# EAGLE design stackable_motorshield_v2 (EAGLE 6.5.0)
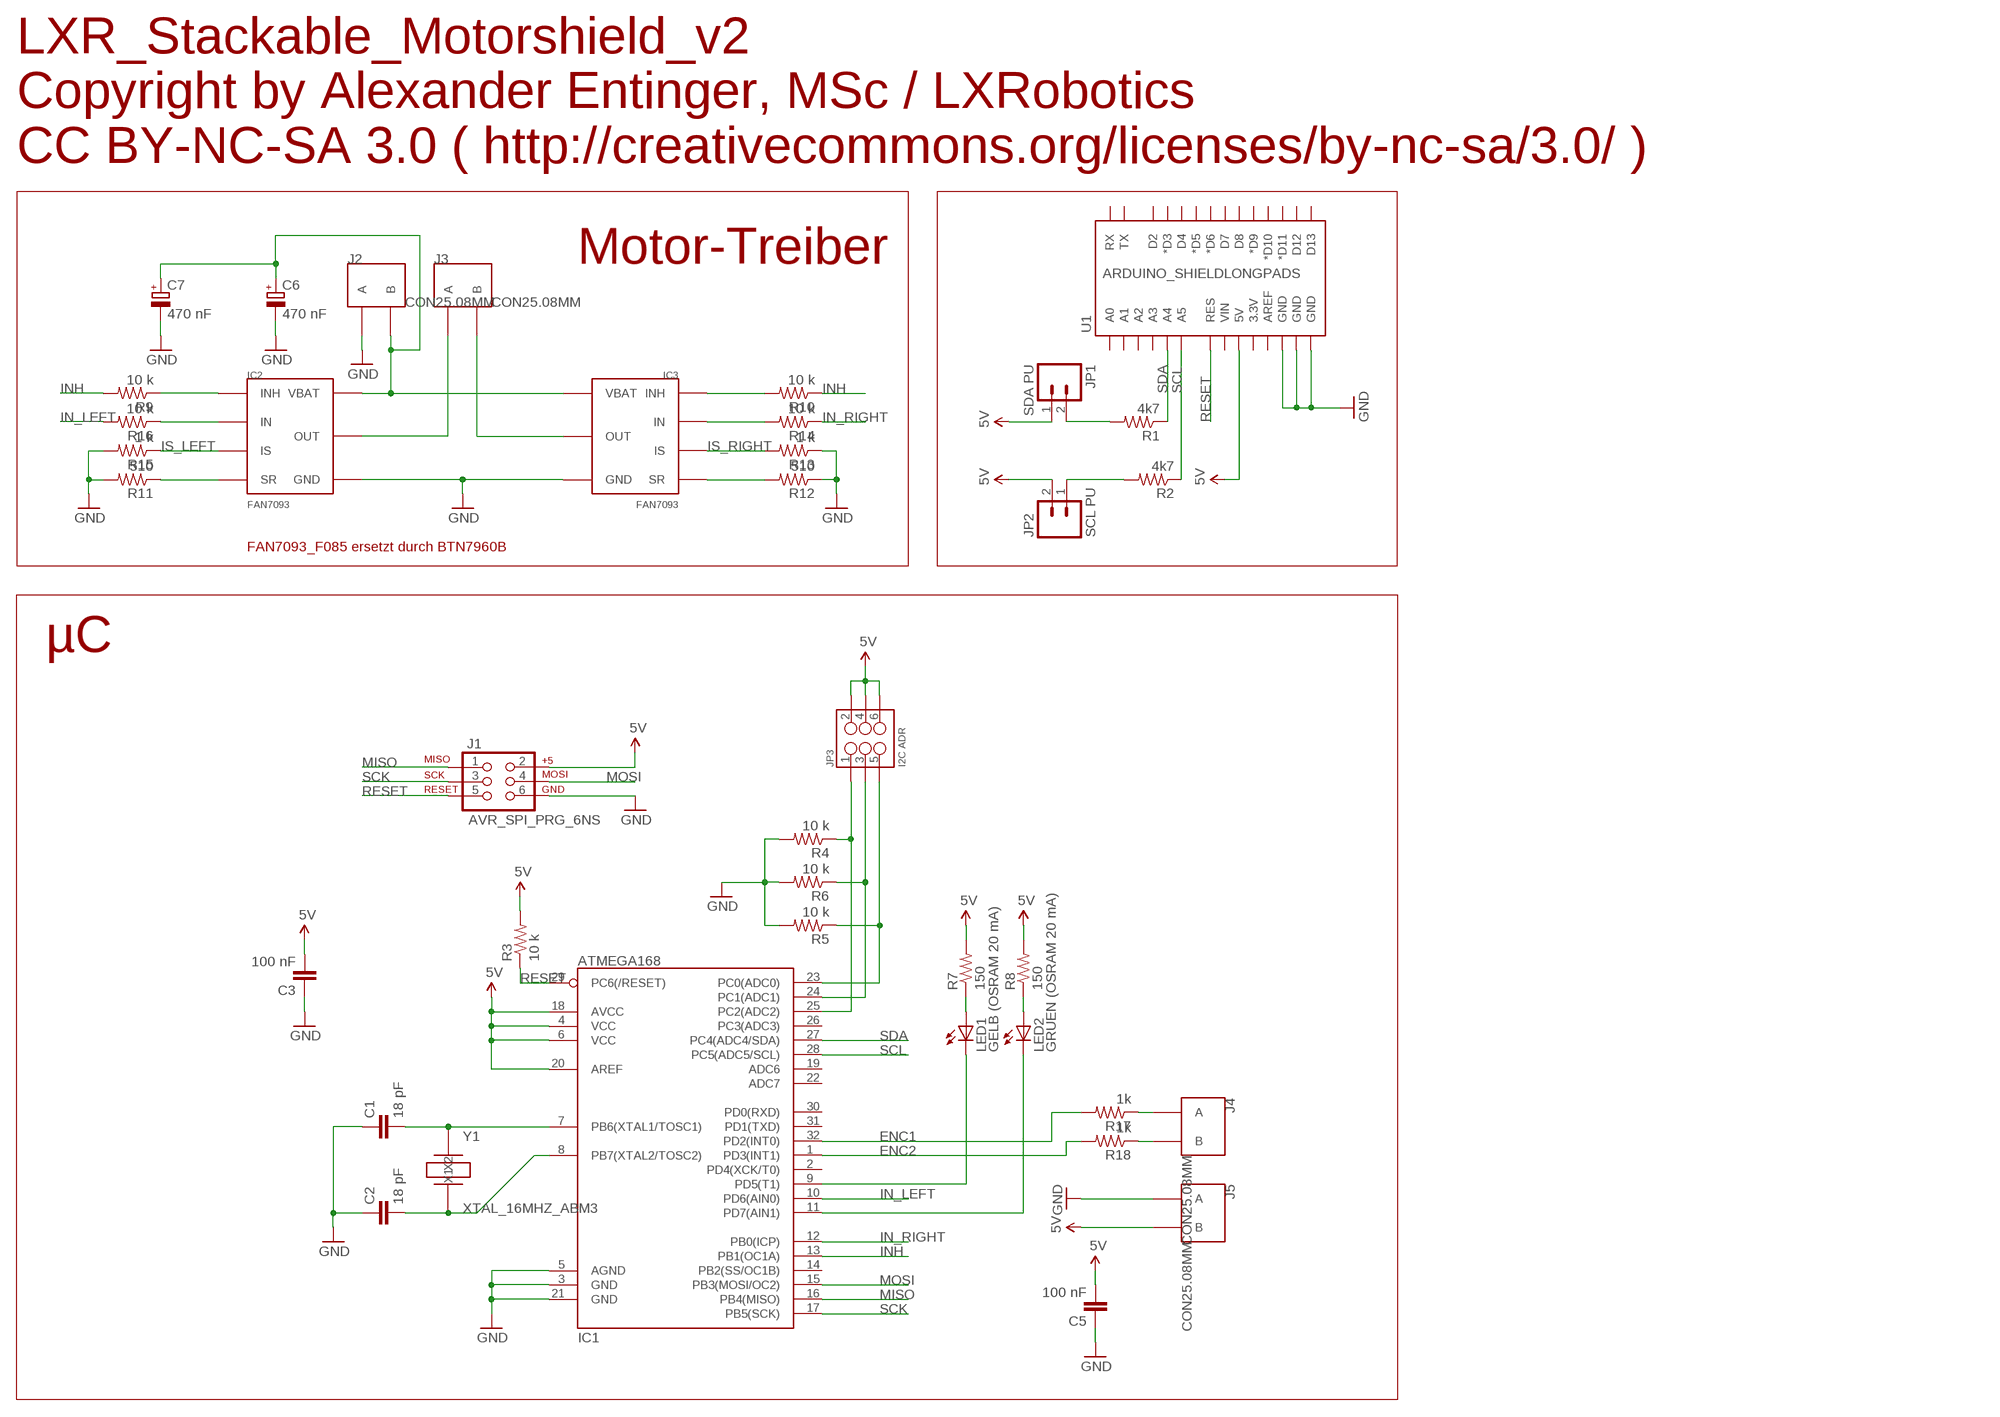
[diagram p0: schematic, sheet 1]

## Parts
C1  18 pF  C-EUC0805  [C0805]
C2  18 pF  C-EUC0805  [C0805]
C3  100 nF  C-EUC0805  [C0805]
C5  100 nF  C-EUC0805  [C0805]
C6  470 nF  CPOL-EU  [KEMET_A]
C7  470 nF  CPOL-EU  [KEMET_A]
IC1  ATMEGA168  [TQFP32-08]
IC2  FAN7093  [TO263-7L]
IC3  FAN7093  [TO263-7L]
J1  AVR_SPI_PRG_6NS  [2X3-NS]
J2  CON25.08MM  [CON2_SCHRAUBKLEMME]
J3  CON25.08MM  [CON2_SCHRAUBKLEMME]
J4  CON25.08MM  [CON2_SCHRAUBKLEMME]
J5  CON25.08MM  [CON2_SCHRAUBKLEMME]
JP1  SDA PU  M02PTH  [1X02]
JP2  SCL PU  M02PTH  [1X02]
JP3  I2C ADR  M03X2POGO_PINS  [2X3_POGO]
LED1  GELB (OSRAM 20 mA)  LEDCHIP-LED0805  [CHIP-LED0805]
LED2  GRUEN (OSRAM 20 mA)  LEDCHIP-LED0805  [CHIP-LED0805]
R1  4k7  RESISTOR0805-RES  [0805]
R2  4k7  RESISTOR0805-RES  [0805]
R3  10 k  RESISTOR0805-RES  [0805]
R4  10 k  RESISTOR0805-RES  [0805]
R5  10 k  RESISTOR0805-RES  [0805]
R6  10 k  RESISTOR0805-RES  [0805]
R7  150  RESISTOR0805-RES  [0805]
R8  150  RESISTOR0805-RES  [0805]
R9  10 k  RESISTOR0805-RES  [0805]
R10  10 k  RESISTOR0805-RES  [0805]
R11  510  RESISTOR0805-RES  [0805]
R12  510  RESISTOR0805-RES  [0805]
R13  1 k  RESISTOR0805-RES  [0805]
R14  10 k  RESISTOR0805-RES  [0805]
R15  1 k  RESISTOR0805-RES  [0805]
R16  10 k  RESISTOR0805-RES  [0805]
R17  1k  RESISTOR0805-RES  [0805]
R18  1k  RESISTOR0805-RES  [0805]
U1  ARDUINO_SHIELDLONGPADS  [DUEMILANOVE_SHIELD_LONGPADS]
Y1  XTAL_16MHZ_ABM3  [ABM3]

## Nets
5V: C3.2 C5.2 IC1.4(VCC) IC1.6(VCC) IC1.18(AVCC) IC1.20(AREF) J1.2 J5.2(B) JP1.1 JP2.2 JP3.P$2 JP3.P$4 JP3.P$6 R3.2 R7.2 R8.2 U1.5V
ENC1: IC1.32(PD2(INT0)) R17.2
ENC2: IC1.1(PD3(INT1)) R18.2
GND: C1.1 C2.1 C3.1 C5.1 C6.CATHODE(-) C7.CATHODE(-) IC1.3(GND) IC1.5(AGND) IC1.21(GND) IC2.GND IC3.GND J1.6 J2.1(A) J5.1(A) R4.2 R5.2 R6.2 R11.2 R12.1 R13.1 R15.2 U1.GND@0(GND) U1.GND@1(GND) U1.GND@2(GND)
IN_LEFT: IC1.10(PD6(AIN0)) R16.2
IN_RIGHT: IC1.12(PB0(ICP)) R14.1
INH: IC1.13(PB1(OC1A)) R9.2 R10.1
IS_LEFT: IC2.IS R15.1
IS_RIGHT: IC3.IS R13.2
MISO: IC1.16(PB4(MISO)) J1.1
MOSI: IC1.15(PB3(MOSI/OC2)) J1.4
N$1: C1.2 IC1.7(PB6(XTAL1/TOSC1)) Y1.X1
N$2: C2.2 IC1.8(PB7(XTAL2/TOSC2)) Y1.X2
N$3: JP2.1 R2.2
N$4: JP1.2 R1.2
N$5: IC1.25(PC2(ADC2)) JP3.P$1 R4.1
N$6: IC1.24(PC1(ADC1)) JP3.P$3 R6.1
N$7: IC1.23(PC0(ADC0)) JP3.P$5 R5.1
N$11: IC1.9(PD5(T1)) LED1.C
N$12: IC1.11(PD7(AIN1)) LED2.C
N$13: LED2.A R8.1
N$14: LED1.A R7.1
N$15: IC2.SR R11.1
N$16: IC3.SR R12.2
N$17: IC2.OUT IC2.OUT@1(OUT) J3.1(A)
N$18: IC2.INH R9.1
N$19: IC3.OUT IC3.OUT@1(OUT) J3.2(B)
N$20: C6.ANODE(+) C7.ANODE(+) IC2.VBATT(VBAT) IC3.VBATT(VBAT) J2.2(B)
N$21: J4.1(A) R17.1
N$22: IC3.INH R10.2
N$23: J4.2(B) R18.1
N$24: IC2.IN R16.1
N$25: IC3.IN R14.2
RESET: IC1.29(PC6(/RESET)) J1.5 R3.1 U1.RES
SCK: IC1.17(PB5(SCK)) J1.3
SCL: IC1.28(PC5(ADC5/SCL)) R2.1 U1.A5
SDA: IC1.27(PC4(ADC4/SDA)) R1.1 U1.A4
Unconnected: IC1.2(PD4(XCK/T0)) IC1.14(PB2(SS/OC1B)) IC1.19(ADC6) IC1.22(ADC7) IC1.26(PC3(ADC3)) IC1.30(PD0(RXD)) IC1.31(PD1(TXD)) U1.3.3V U1.A0 U1.A1 U1.A2 U1.A3 U1.AREF U1.D2 U1.D3(*D3) U1.D4 U1.D5(*D5) U1.D6(*D6) U1.D7 U1.D8 U1.D9(*D9) U1.D10(*D10) U1.D11(*D11) U1.D12 U1.D13 U1.RX U1.TX U1.VIN

## Notes on the sheet
- LXR_Stackable_Motorshield_v2 
  Copyright by Alexander Entinger, MSc / LXRobotics
  CC BY-NC-SA 3.0 ( http://creativecommons.org/licenses/by-nc-sa/3.0/ )
- Motor-Treiber
- FAN7093_F085 ersetzt durch BTN7960B
- µC

## Library data of the parts
C1-C3 C5 = rcl:C-EU: CAPACITOR, European symbol
C6 C7 = lxrobotics:CPOL-EU: POLARIZED CAPACITOR, European symbol
IC1 = SparkFun-DigitalIC:ATMEGA168: Atmel 32-pin 8-bit micro, 16k flash.
IC2 IC3 = lxrobotics:FAN7093
J1 = SparkFun-Connectors:AVR_SPI_PRG_6: AVR ISP 6 Pin This is the reduced ISP connector for AVR programming. Common on Arduino. This footprint will take up less PCB space and can be used with a 10-pin to 6-pin adapter such as SKU: BOB-08508
J2-J5 = lxrobotics:CON2
JP1 JP2 = SparkFun-Connectors:M02: Header 2 Standard 2-pin 0.1" header. Use with straight break away headers (SKU : PRT-00116), right angle break away headers (PRT-00553), swiss pins (PRT-00743), machine pins (PRT-00117), and female headers (PRT-00115). Molex polarized connector foot print use with SKU : PRT-08233 with associated crimp pins and housings.
JP3 = SparkFun-Connectors:M03X2: 2x3 .1" header. Shrouded, with keying- CONN-10681 SMT- CONN-11415 Pogo pins- HW-11044; PROD_ID: HW-11044
LED1 LED2 = led:LED: LED OSRAM: - CHIPLED LG R971, LG N971, LY N971, LG Q971, LY Q971, LO R971, LY R971 LH N974, LH R974 LS Q976, LO Q976, LY Q976 LO Q996 - Hyper CHIPLED LW Q18S LB Q993, LB Q99A, LB R99A - SideLED LS A670, LO A670, LY A670, LG A670, LP A670 LB A673, LV A673, LT A673, LW A673 LH A674 LY A675 LS A676, LA A676, LO A676, LY A676, LW A676 LS A679, LY A679, LG A679 - Hyper Micro SIDELED® LS Y876, LA Y876, LO Y876, LY Y876 LT Y87S - SmartLED LW L88C, LW L88S LB L89C, LB L89S, LG L890 LS L89K, LO L89K, LY L89K LS L896, LA L896, LO L896, LY L896 - TOPLED LS T670, LO T670, LY T670, LG T670, LP T670 LSG T670, LSP T670, LSY T670, LOP T670, LYG T670 LG T671, LOG T671, LSG T671 LB T673, LV T673, LT T673, LW T673 LH T674 LS T676, LA T676, LO T676, LY T676, LB T676, LH T676, LSB T676, LW T676 LB T67C, LV T67C, LT T67C, LS T67K, LO T67K, LY T67K, LW E67C LS E67B, LA E67B, LO E67B, LY E67B, LB E67C, LV E67C, LT E67C LW T67C LS T679, LY T679, LG T679 LS T770, LO T770, LY T770, LG T770, LP T770 LB T773, LV T773, LT T773, LW T773 LH T774 LS E675, LA E675, LY E675, LS T675 LS T776, LA T776, LO T776, LY T776, LB T776 LHGB T686 LT T68C, LB T68C - Hyper Mini TOPLED® LB M676 - Mini TOPLED Santana® LG M470 LS M47K, LO M47K, LY M47K Source: http://www.osram.convergy.de LUXEON: - LUMILED® LXK2-PW12-R00, LXK2-PW12-S00, LXK2-PW14-U00, LXK2-PW14-V00 LXK2-PM12-R00, LXK2-PM12-S00, LXK2-PM14-U00 LXK2-PE12-Q00, LXK2-PE12-R00, LXK2-PE12-S00, LXK2-PE14-T00, LXK2-PE14-U00 LXK2-PB12-K00, LXK2-PB12-L00, LXK2-PB12-M00, LXK2-PB14-N00, LXK2-PB14-P00, LXK2-PB14-Q00 LXK2-PR12-L00, LXK2-PR12-M00, LXK2-PR14-Q00, LXK2-PR14-R00 LXK2-PD12-Q00, LXK2-PD12-R00, LXK2-PD12-S00 LXK2-PH12-R00, LXK2-PH12-S00 LXK2-PL12-P00, LXK2-PL12-Q00, LXK2-PL12-R00 Source: www.luxeon.com KINGBRIGHT: KA-3528ASYC Source: www.kingbright.com
R1-R18 = SparkFun-Resistors:RESISTOR: Resistor Basic schematic elements and footprints for 0603, 1206, and PTH resistors.
U1 = SparkFun-Boards:ARDUINO_SHIELD: Arduino shield footprint
Y1 = lxrobotics:XTAL_16MHZ_ABM3

## Board
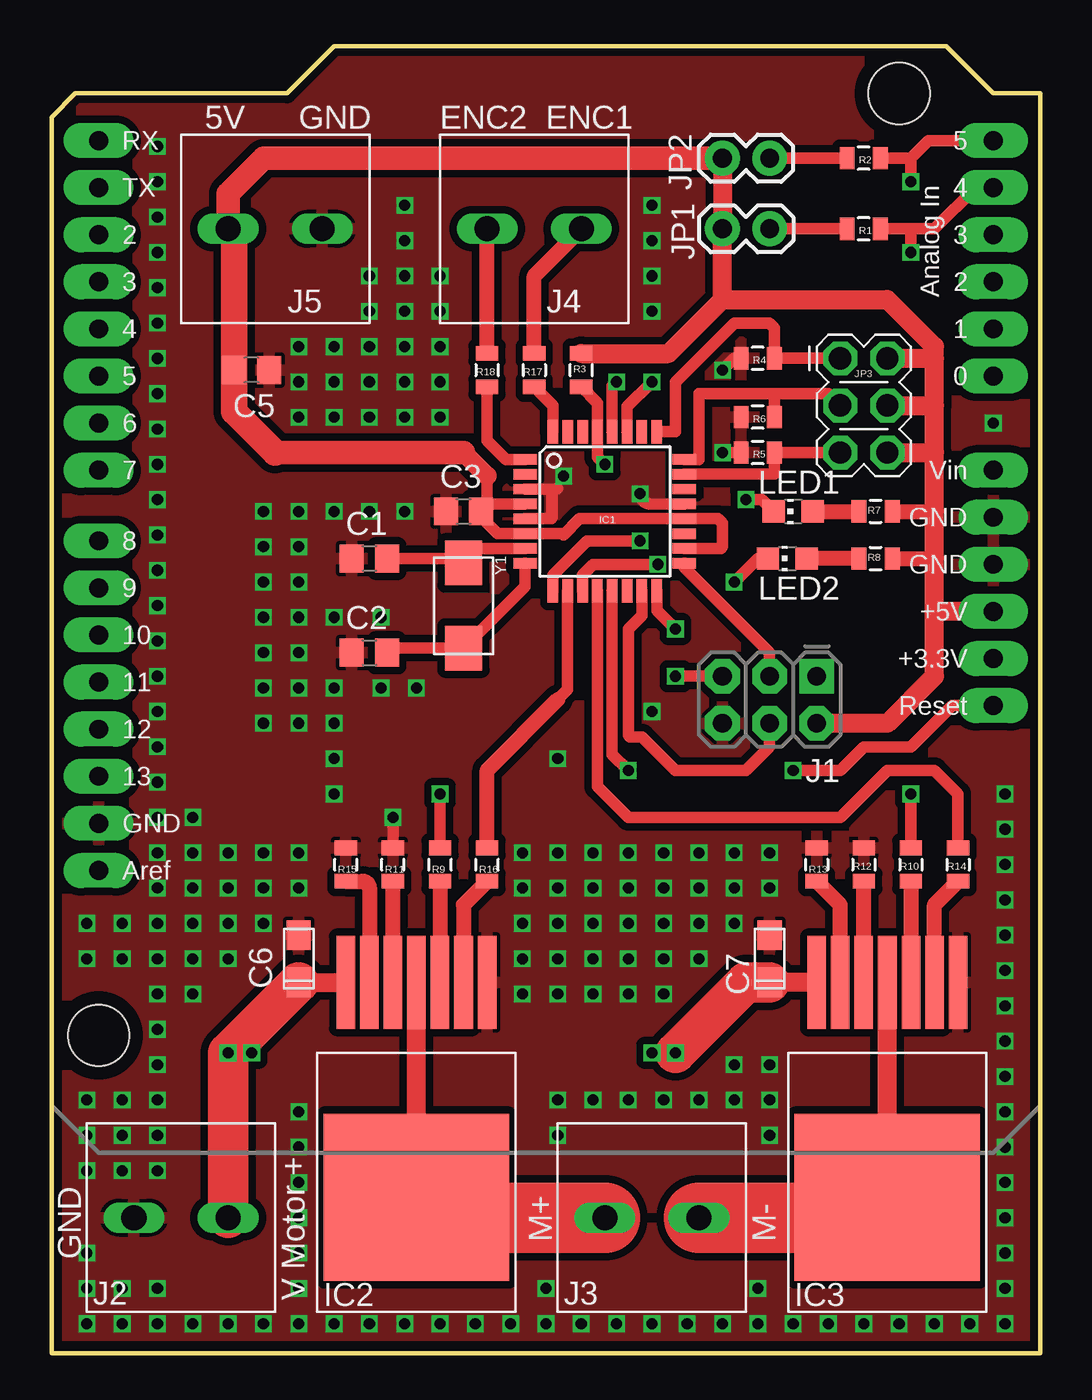
[diagram p1: board, top side]
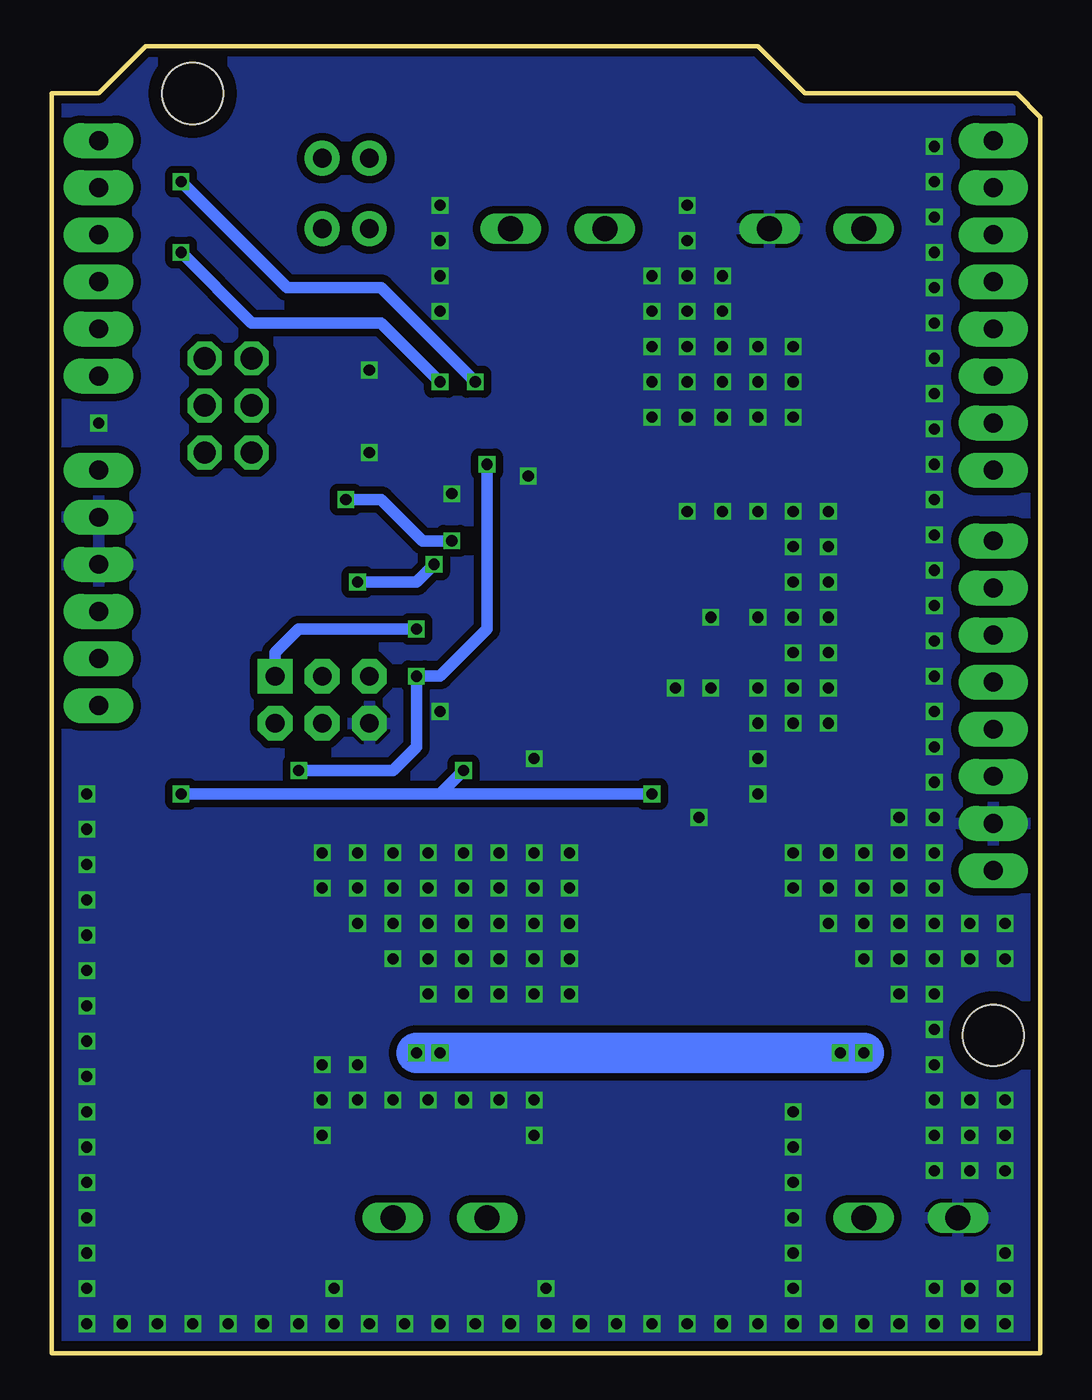
[diagram p2: board, bottom side, seen from below]

Size 53.34 x 70.48 mm. Coordinates in mm from the lower left corner, seen from the top.
Outline: 0,0 53.34,0 53.34,67.95 50.8,67.95 48.26,70.48 15.24,70.48 12.7,67.95 1.27,67.95 0,66.68 0,0
Copper layers (1*16): Top 0.035mm / dielectric 1.5mm / Bottom 0.035mm
Design rules "LeitOn - Standard-Eagle-DRU - 1- und  2-Lagen DK - deutsch - Rev 2.0": minimum track width 0.15mm, minimum drill 0.3mm, track to track 0.15mm, track to pad 0.15mm, pad to pad 0.15mm, via to via 0.15mm, smd to smd 0.15mm, copper to edge 0.3mm, drill to drill 0.3mm, minimum pad ring 0.15mm, minimum via ring 0.15mm, stop-mask expansion 0.075mm, vias tented up to drill 0mil, thermal gap 0.2mm

### Footprints (pad centres in the part's own frame; a part is rotated, then mirrored left to right if it is on the bottom)
C0805 = smd 1.3 x 1.5: 1 -0.95,0; 2 0.95,0
KEMET_A = smd 1.6 x 1.3: ANODE 1.275,0; CATHODE -1.275,0
TQFP32-08 = smd 1.27 x 0.559: 1 -4.293,2.8; 2 -4.293,2; 3 -4.293,1.2; 4 -4.293,0.4; 5 -4.293,-0.4; 6 -4.293,-1.2; 7 -4.293,-2; 8 -4.293,-2.8; 17 4.293,-2.8; 18 4.293,-2; 19 4.293,-1.2; 20 4.293,-0.4; 21 4.293,0.4; 22 4.293,1.2; 23 4.293,2; 24 4.293,2.8 | smd 0.559 x 1.27: 9 -2.8,-4.293; 10 -2,-4.293; 11 -1.2,-4.293; 12 -0.4,-4.293; 13 0.4,-4.293; 14 1.2,-4.293; 15 2,-4.293; 16 2.8,-4.293; 25 2.8,4.293; 26 2,4.293; 27 1.2,4.293; 28 0.4,4.293; 29 -0.4,4.293; 30 -1.2,4.293; 31 -2,4.293; 32 -2.8,4.293
TO263-7L = smd 1 x 5: GND -3.81,0; IN -2.54,0; INH -1.27,0; IS 2.54,0; OUT 0,0; SR 1.27,0; VBATT 3.81,0 | smd 10 x 9: OUT@1 0,11.6
2X3-NS = drill 1.016 pad 1.88 square: 1 -2.54,-1.27 | drill 1.016 pad 1.88 octagon: 2 -2.54,1.27; 3 0,-1.27; 4 0,1.27; 5 2.54,-1.27; 6 2.54,1.27
CON2_SCHRAUBKLEMME = drill 1.35 long: 1 -2.54,0; 2 2.54,0
1X02 = drill 1.016 pad 1.88: 1 0,0; 2 2.54,0
2X3_POGO = drill 1.2 pad 1.829 octagon: P$1 0,0; P$2 0,2.54; P$3 2.54,0; P$4 2.54,2.54; P$5 5.08,0; P$6 5.08,2.54
CHIP-LED0805 = smd 1.2 x 1.2: A 0,-1.05; C 0,1.05
0805 = smd 0.8 x 1.2: 1 -0.9,0; 2 0.9,0
DUEMILANOVE_SHIELD_LONGPADS = drill 1.016 pad 1.88 long: 3.3V 50.8,26.67; 5V 50.8,29.21; A0 50.8,41.91; A1 50.8,44.45; A2 50.8,46.99; A3 50.8,49.53; A4 50.8,52.07; A5 50.8,54.61; AREF 2.54,15.24; D2 2.54,49.53; D3 2.54,46.99; D4 2.54,44.45; D5 2.54,41.91; D6 2.54,39.37; D7 2.54,36.83; D8 2.54,33.02; D9 2.54,30.48; D10 2.54,27.94; D11 2.54,25.4; D12 2.54,22.86; D13 2.54,20.32; GND@0 50.8,31.75; GND@1 50.8,34.29; GND@2 2.54,17.78; RES 50.8,24.13; RX 2.54,54.61; TX 2.54,52.07; VIN 50.8,36.83 | hole 3.302: 45.72,57.15; 2.54,6.35
ABM3 = smd 2.4 x 2: X1 -2.3,0; X2 2.3,0

### Placement (x,y rotation side)
C1  17.15,42.86 0 top
C2  17.15,37.78 0 top
C3  22.23,45.4 0 top
C5  10.8,53.02 180 top
C6  13.34,21.27 270 top
C7  38.73,21.27 270 top
IC1  29.84,45.4 0 top
IC2  19.69,20 180 top
IC3  45.09,20 180 top
J1  38.73,35.24 180 top
J2  6.98,7.3 0 top
J3  32.38,7.3 0 top
J4  26.04,60.64 180 top
J5  12.07,60.64 180 top
JP1  36.2,60.64 0 top
JP2  38.73,64.45 180 top
JP3  42.55,53.66 270 top
LED1  40.01,45.4 90 top
LED2  39.69,42.86 90 top
R1  43.81,60.64 180 top
R2  43.81,64.45 180 top
R3  28.58,53.02 90 top
R4  38.1,53.66 180 top
R5  38.1,48.58 180 top
R6  38.1,50.48 180 top
R7  44.45,45.4 0 top
R8  44.45,42.86 0 top
R9  20.95,26.35 90 top
R10  46.35,26.35 270 top
R11  18.41,26.35 90 top
R12  43.81,26.35 270 top
R13  41.27,26.35 270 top
R14  48.9,26.35 270 top
R15  15.88,26.35 90 top
R16  23.49,26.35 90 top
R17  26.04,53.02 270 top
R18  23.49,53.02 270 top
U1  0,10.79 0 top
Y1  22.23,40.32 270 top

### Tracks (layer width: path | path; a pad name or v marks a point on that pad's centre or on a via)
5V
  Top 0.61: IC1.4 23.58,45.8 C3.2 23.18,45.09 23.49,44.77 | 23.49,44.77 24.06,44.2 IC1.6 27.55,44.2 arc-90 27.62,44.13 28.49,45 IC1.20 35.96,45 36.2,44.77 36.2,43.5 36.1,43.4 IC1.18 | 23.49,44.77 23.49,47.31
  Top 0.813: 36.2,56.83 JP2.2 | R7.2 47.63,45.4 | R8.2 47.63,42.86
  Top 1.016: JP2.2 JP1.1 36.2,56.83 | R3.2 33.29,53.92 36.2,56.83 | 47.63,40.32 47.63,36.51 45.09,33.97 J1.2 | 47.63,40.32 47.63,42.86 47.63,45.4 47.63,48.58 | 47.63,48.58 47.63,51.12 | 47.63,51.12 47.63,53.66 | 47.63,53.66 47.63,54.29 45.09,56.83 36.2,56.83 | 23.49,47.31 22.23,48.58 | JP3.P$2 47.63,53.66 | JP3.P$4 47.63,51.12 | JP3.P$6 47.63,48.58 | U1.5V 47.94,40 arc-90 47.63,40.32
  Top 1.27: JP2.2 11.43,64.45 9.53,62.55 J5.2 | 22.23,48.58 12.07,48.58
  Top 1.422: J5.2 9.85,60.32 C5.2 9.85,50.8 12.07,48.58
ENC1
  Top 0.61: R17.2 27.05,51.11 IC1.32
ENC2
  Top 0.61: IC1.1 24.51,48.2 23.49,49.21 R18.2
GND  (via drill 0.6)
  Top 0.61: IC1.3 27.23,46.6 | 27.23,46.6 arc90 27.3,46.67 | v18.41,28.89 R11.2 | R5.2 v36.2,48.58 | v36.2,53.02 36.83,53.66 R4.2 | IC1.5 26.91,45 arc90 26.99,45.09 26.99,46.35 arc-90 27.23,46.6 | IC1.21 32.3,45.8 arc-90 v31.75,46.35
  other vias: 5.71,25.08 7.62,25.08 9.53,25.08 11.43,25.08 13.34,25.08 3.81,23.18 5.71,23.18 7.62,23.18 9.53,23.18 11.43,23.18 1.91,21.27 3.81,21.27 5.71,21.27 7.62,21.27 9.53,21.27 7.62,26.99 9.53,26.99 5.71,19.37 7.62,19.37 1.91,23.18 11.43,26.99 5.71,17.46 13.34,26.99 7.62,28.89 5.71,15.56 1.91,13.65 3.81,13.65 5.71,13.65 1.91,11.75 3.81,11.75 5.71,11.75 5.71,9.84 3.81,9.84 1.91,9.84 1.91,5.4 1.91,3.49 3.81,3.49 5.71,3.49 1.91,1.59 3.81,1.59 5.71,1.59 7.62,1.59 9.53,1.59 11.43,1.59 13.34,1.59 13.34,3.49 13.34,5.4 13.34,7.3 13.34,9.21 13.34,11.11 13.34,13.02 15.24,1.59 17.15,1.59 19.05,1.59 20.95,1.59 22.86,1.59 24.77,1.59 26.67,1.59 26.67,3.49 28.58,1.59 30.48,1.59 32.38,1.59 34.29,1.59 36.2,1.59 38.1,1.59 38.1,3.49 40.01,1.59 41.91,1.59 43.81,1.59 45.72,1.59 47.63,1.59 49.53,1.59 27.3,11.75 27.3,13.65 29.21,13.65 31.12,13.65 33.02,13.65 34.93,13.65 36.83,13.65 36.83,15.56 38.73,15.56 38.73,13.65 38.73,11.75 25.4,19.37 25.4,21.27 25.4,23.18 25.4,25.08 25.4,26.99 27.3,26.99 27.3,25.08 27.3,23.18 27.3,21.27 27.3,19.37 29.21,23.18 31.12,23.18 33.02,23.18 34.93,23.18 36.83,23.18 29.21,21.27 31.12,21.27 34.93,21.27 33.02,21.27 29.21,19.37 31.12,19.37 33.02,19.37 13.34,35.88 15.24,35.88 17.78,35.88 19.69,35.88 13.34,37.78 13.34,39.69 15.24,39.69 17.78,39.69 11.43,37.78 13.34,41.59 13.34,43.5 13.34,45.4 15.24,45.4 17.15,45.4 19.05,45.4 11.43,45.4 11.43,43.5 11.43,41.59 11.43,39.69 11.43,35.88 15.24,33.97 15.24,32.07 15.24,30.16 32.38,56.2 13.34,33.97 31.12,26.99 33.02,26.99 34.93,26.99 36.83,26.99 29.21,26.99 27.3,32.07 19.05,61.91 19.05,60.01 17.15,58.1 19.05,58.1 20.95,58.1 20.95,56.2 19.05,56.2 17.15,56.2 13.34,54.29 15.24,54.29 17.15,54.29 19.05,54.29 20.95,54.29 13.34,52.39 15.24,52.39 17.15,52.39 19.05,52.39 20.95,52.39 13.34,50.48 15.24,50.48 17.15,50.48 19.05,50.48 20.95,50.48 32.38,34.61 32.38,61.91 32.38,60.01 32.38,58.1 51.43,1.59 51.43,3.49 51.43,5.4 51.43,7.3 51.43,9.21 51.43,11.11 51.43,13.02 51.43,14.92 51.43,16.83 51.43,18.73 51.43,20.64 51.43,22.54 51.43,24.45 51.43,26.35 51.43,28.26 51.43,30.16 50.8,50.16 5.71,26.99 5.71,28.89 5.71,30.8 5.71,32.7 5.71,34.61 5.71,36.51 5.71,38.42 5.71,40.32 5.71,42.23 5.71,44.13 5.71,46.04 5.71,47.94 5.71,49.85 5.71,51.75 5.71,53.66 5.71,55.56 5.71,57.47 5.71,59.37 5.71,61.28 5.71,63.18 5.71,65.09 11.43,33.97 38.73,26.99 29.21,25.08 31.12,25.08 33.02,25.08 34.93,25.08 36.83,25.08 38.73,25.08 27.62,47.31
  pour Bottom (isolate 0.406): 0.32,0.95 53.02,0.95 53.02,67.63 50.8,67.63 50.48,67.63 47.94,70.17 15.56,70.17 13.02,67.63 1.59,67.63 0.32,66.36
  pour Top (isolate 0.406): 0.32,0.95 53.02,0.95 53.02,67.63 50.48,67.63 47.94,70.17 15.56,70.17 13.02,67.63 1.59,67.63 0.32,66.36
IN_LEFT
  Top 0.61: 27.3,35.24 27.84,35.78 IC1.10
  Top 0.813: R16.2 23.49,31.43 27.3,35.24
IN_RIGHT
  Top 0.61: IC1.12 29.45,30.56 31.12,28.89 42.55,28.89 45.09,31.43 47.63,31.43 48.9,30.16 R14.1
INH  (via drill 0.6)
  Top 0.61: R9.2 v20.95,30.16 | v46.35,30.16 R10.1 | IC1.13 30.24,32.3 v31.12,31.43
  Bottom 0.61: v20.95,30.16 32.38,30.16 | 32.38,30.16 v46.35,30.16 | v31.12,31.43 32.38,30.16
IS_LEFT
  Top 0.813: IC2.IS 17.15,25.08 arc90 16.77,25.45 R15.1
IS_RIGHT
  Top 0.813: IC3.IS 42.55,24.18 R13.2
MISO  (via drill 0.6)
  Top 0.61: v33.66,39.05 32.65,40.06 IC1.16
  Bottom 0.61: J1.1 41.27,37.78 40.01,39.05 v33.66,39.05
MOSI
  Top 0.61: J1.4 38.73,32.7 37.47,31.43 33.66,31.43 31.84,33.24 31.21,33.24 31.12,33.34 31.12,39.05 31.84,39.78 IC1.15
N$1
  Top 0.61: IC1.7 23.01,43.4 Y1.X1 22.23,42.86 C1.2
N$2
  Top 0.61: IC1.8 25.55,41.35 Y1.X2 18.34,38.02 C2.2
N$3
  Top 0.61: JP2.1 R2.2
N$4
  Top 0.61: JP1.2 R1.2
N$5
  Top 0.61: IC1.25 33.66,49.7 33.66,52.39 36.83,55.56 38.73,55.56 39,55.3 R4.1 JP3.P$1
N$6
  Top 0.61: IC1.24 34.93,48.2 34.93,51.75 38.73,51.75 39,51.75 | 39,51.75 41.91,51.75 JP3.P$3 | R6.1 39,51.75
N$7
  Top 0.61: IC1.23 39,47.4 R5.1 JP3.P$5
N$11  (via drill 0.6)
  Top 0.61: LED1.C 38.32,46.04 v37.47,46.04 | v31.75,43.81 28.89,43.81 27.05,41.97 IC1.9
  Bottom 0.61: v37.47,46.04 35.56,46.04 33.34,43.81 v31.75,43.81
N$12  (via drill 0.6)
  Top 0.61: LED2.C 38.1,42.86 v36.83,41.59 | v32.7,42.55 29.21,42.55 28.65,41.98 IC1.11
  Bottom 0.61: v36.83,41.59 33.66,41.59 v32.7,42.55
N$13
  Top 0.813: R8.1 LED2.A
N$14
  Top 0.813: LED1.A R7.1
N$15
  Top 0.813: IC2.SR R11.1
N$16
  Top 0.813: IC3.SR R12.2
N$17
  Top 0.61: IC2.OUT@1 19.69,7.3
  Top 1.016: IC2.OUT@1 IC2.OUT
  Top 3.81: J3.1 19.69,7.3
N$18
  Top 0.813: R9.1 IC2.INH
N$19
  Top 1.016: IC3.OUT@1 IC3.OUT
  Top 3.81: J3.2 43.98,7.3 IC3.OUT@1
N$20  (via drill 0.6)
  Top 1.016: IC2.VBATT C6.ANODE | IC3.VBATT C7.ANODE
  Top 1.27: C6.ANODE | C7.ANODE
  Top 2.184: v33.66,16.19 37.47,20 C7.ANODE | J2.2 v9.53,16.19 C6.ANODE
  Bottom 2.184: v33.66,16.19 v32.38,16.19 v10.8,16.19 v9.53,16.19
N$21
  Top 0.813: R17.1 26.04,58.1 J4.1
N$22
  Top 0.813: R10.2 IC3.INH
N$23
  Top 0.813: R18.1 J4.2
N$24
  Top 0.813: R16.1 22.23,24.18 IC2.IN
N$25
  Top 0.813: IC3.IN 47.63,24.18 R14.2
RESET  (via drill 0.6)
  Top 0.61: R3.1 29.45,51.25 IC1.29 29.45,48.34 v29.84,47.94 | v33.66,36.51 J1.5 | v40.01,31.43 42.55,31.43 43.81,32.7 46.35,32.7 48.58,34.92 U1.RES
  Bottom 0.61: v29.84,47.94 29.84,39.05 32.38,36.51 v33.66,36.51 33.66,32.7 34.93,31.43 v40.01,31.43
SCK
  Top 0.61: J1.3 38.73,37.78 34.14,42.38 IC1.17
SCL  (via drill 0.6)
  Top 0.61: R2.1 46.35,64.45 | IC1.28 30.24,52.15 v30.48,52.39 | v46.35,63.18 46.35,64.45 | 46.35,64.45 47.31,65.4 U1.A5
  Bottom 0.61: v30.48,52.39 35.56,57.47 40.64,57.47 v46.35,63.18
SDA  (via drill 0.6)
  Top 0.61: R1.1 46.35,60.64 | 46.35,60.64 47.63,60.64 49.85,62.87 U1.A4 | IC1.27 31.05,51.05 v32.38,52.39 | v46.35,59.37 46.35,60.64
  Bottom 0.61: v32.38,52.39 35.56,55.56 42.55,55.56 v46.35,59.37

### Text on the board
tNames: 5V | GND | ENC2 | ENC1 | M+ | M- | GND | V Motor +